# EAGLE design weather-cube_main_board (EAGLE 7.3.0)
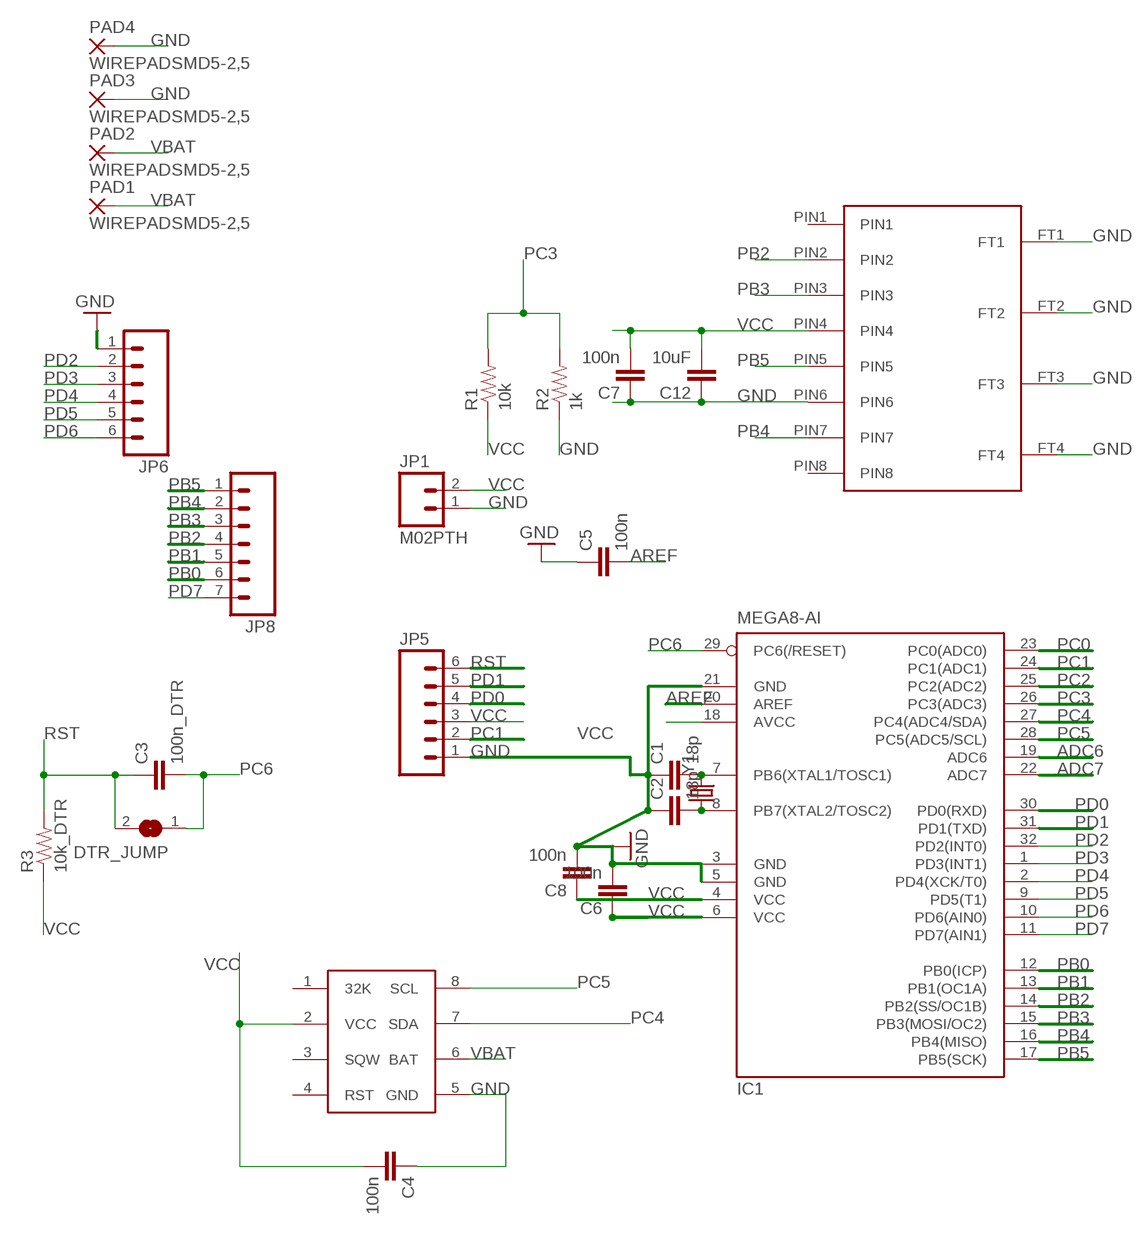
[diagram p0: schematic, sheet 1]

## Parts
*RTC  DS3231M  [DS3231M]
C1  18p  CAP0603-CAP  [0603-CAP]
C2  18p  CAP0603-CAP  [0603-CAP]
C3  100n_DTR  CAP0603-CAP  [0603-CAP]
C4  100n  CAP0603-CAP  [0603-CAP]
C5  100n  CAP0603-CAP  [0603-CAP]
C6  100n  CAP0603-CAP  [0603-CAP]
C7  100n  CAP0603-CAP  [0603-CAP]
C8  100n  CAP0603-CAP  [0603-CAP]
C12  10uF  CAP0603-CAP  [0603-CAP]
DTR_JUMP  SJ  [SJ]
IC1  MEGA8-AI  [TQFP32-08]
JP1  M02PTH  [1X02]
JP5  M06SIP  [1X06]
JP6  M06SIP  [1X06]
JP8  M07  [1X07]
MICRO-SD  MICROSD-1010030368  [MICROSD-1010030368]
PAD1  WIREPADSMD5-2,5  [5-2,5]
PAD2  WIREPADSMD5-2,5  [5-2,5]
PAD3  WIREPADSMD5-2,5  [5-2,5]
PAD4  WIREPADSMD5-2,5  [5-2,5]
R1  10k  RESISTOR0603  [0603-RES]
R2  1k  RESISTOR0603  [0603-RES]
R3  10k_DTR  RESISTOR0603  [0603-RES]
Y1  CRYSTAL5X3  [CRYSTAL-SMD-5X3]

## Nets
ADC6: IC1.19(ADC6)
ADC7: IC1.22(ADC7)
AREF: C5.2 IC1.20(AREF)
GND: *RTC.5(GND) C1.1 C2.1 C4.1 C5.1 C6.2 C7.1 C8.2 C12.1 IC1.3(GND) IC1.5(GND) IC1.21(GND) JP1.1 JP5.1 JP6.1 MICRO-SD.FT1 MICRO-SD.FT2 MICRO-SD.FT3 MICRO-SD.FT4 MICRO-SD.PIN6 PAD3.1(P) PAD4.1(P) R2.1
PB0: IC1.12(PB0(ICP)) JP8.6
PB1: IC1.13(PB1(OC1A)) JP8.5
PB2: IC1.14(PB2(SS/OC1B)) JP8.4 MICRO-SD.PIN2
PB3: IC1.15(PB3(MOSI/OC2)) JP8.3 MICRO-SD.PIN3
PB4: IC1.16(PB4(MISO)) JP8.2 MICRO-SD.PIN7
PB5: IC1.17(PB5(SCK)) JP8.1 MICRO-SD.PIN5
PC0: IC1.23(PC0(ADC0))
PC1: IC1.24(PC1(ADC1)) JP5.2
PC2: IC1.25(PC2(ADC2))
PC3: IC1.26(PC3(ADC3)) R1.2 R2.2
PC4: *RTC.7(SDA) IC1.27(PC4(ADC4/SDA))
PC5: *RTC.8(SCL) IC1.28(PC5(ADC5/SCL))
PC6: C3.2 DTR_JUMP.1 IC1.29(PC6(/RESET))
PD0: IC1.30(PD0(RXD)) JP5.4
PD1: IC1.31(PD1(TXD)) JP5.5
PD2: IC1.32(PD2(INT0)) JP6.2
PD3: IC1.1(PD3(INT1)) JP6.3
PD4: IC1.2(PD4(XCK/T0)) JP6.4
PD5: IC1.9(PD5(T1)) JP6.5
PD6: IC1.10(PD6(AIN0)) JP6.6
PD7: IC1.11(PD7(AIN1)) JP8.7
Q1: C2.2 IC1.8(PB7(XTAL2/TOSC2)) Y1.1
Q2: C1.2 IC1.7(PB6(XTAL1/TOSC1)) Y1.3
RST: C3.1 DTR_JUMP.2 JP5.6 R3.2
VBAT: *RTC.6(BAT) PAD1.1(P) PAD2.1(P)
VCC: *RTC.2(VCC) C4.2 C6.1 C7.2 C8.1 C12.2 IC1.4(VCC) IC1.6(VCC) IC1.18(AVCC) JP1.2 JP5.3 MICRO-SD.PIN4 R1.1 R3.1
Unconnected: *RTC.1(32K) *RTC.3(SQW) *RTC.4(RST) MICRO-SD.PIN1 MICRO-SD.PIN8

## Library data of the parts
*RTC = open_source_turbidimeter:DS3231M
C1-C8 C12 = SparkFun:CAP: Capacitor Standard 0603 ceramic capacitor, and 0.1" leaded capacitor.
DTR_JUMP = jumper:SJ: SMD solder JUMPER
IC1 = atmel:MEGA8: MICROCONTROLLER 8 Kbytes FLASH, 1 kbytes SRAM, 512 bytes EEPROM, USART, 6-channel 10 bit ADC, 2-channel 8 bit ADC Pin compatible with Atmega48, ATMega88, ATMega168 Source: avr.lbr; MPN: ATMEGA8-16AU; OC_FARNELL: 9171371; OC_NEWARK: 73M8863
JP1 = SparkFun-Connectors:M02: Standard 2-pin 0.1" header. Use with - straight break away headers ( PRT-00116) - right angle break away headers (PRT-00553) - swiss pins (PRT-00743) - machine pins (PRT-00117) - female headers (PRT-00115) Molex polarized connector foot print use with: PRT-08233 with associated crimp pins and housings. 2.54_SCREWTERM for use with PRT-10571. 3.5mm Screw Terminal footprints for PRT-08084 5mm Screw Terminal footprints for use with PRT-08433
JP5 JP6 = SparkFun-Connectors:M06: Header 6 Standard 6-pin 0.1" header. Use with straight break away headers (SKU : PRT-00116), right angle break away headers (PRT-00553), swiss pins (PRT-00743), machine pins (PRT-00117), and female headers (PRT-00115). Molex polarized connector foot print use with SKU : PRT-08094 with associated crimp pins and housings. NOTES ON THE VARIANTS LOCK and LOCK_LONGPADS... This footprint was designed to help hold the alignment of a through-hole component (i.e. 6-pin header) while soldering it into place. You may notice that each hole has been shifted either up or down by 0.005 of an inch from it's more standard position (which is a perfectly straight line). This slight alteration caused the pins (the squares in the middle) to touch the edges of the holes. Because they are alternating, it causes a "brace" to hold the component in place. 0.005 has proven to be the perfect amount of "off-center" position when using our standard breakaway headers. Although looks a little odd when you look at the bare footprint, once you have a header in there, the alteration is very hard to notice. Also,if you push a header all the way into place, it is covered up entirely on the bottom side. This idea of altering the position of holes to aid alignment will be further integrated into the Sparkfun Library for other footprints. It can help hold any component with 3 or more connection pins.
JP8 = SparkFun:M07: Header 7 Standard 7-pin 0.1" header. Use with straight break away headers (SKU : PRT-00116), right angle break away headers (PRT-00553), swiss pins (PRT-00743), machine pins (PRT-00117), and female headers (PRT-00115). NOTES ON THE VARIANTS LOCK and LOCK_LONGPADS... This footprint was designed to help hold the alignment of a through-hole component (i.e. 7-pin header) while soldering it into place. You may notice that each hole has been shifted either up or down by 0.005 of an inch from it's more standard position (which is usually a perfectly straight line). This slight alteration caused the pins (the squares in the middle) to touch the edges of the holes. Because they are alternating, it causes a "brace" to hold the header in place. 0.005 has proven to be the perfect amount of "off-center" position when using our standard breakaway headers. Although looks a little odd when you look at the bare footprint, once you have a header in there, the alteration is very hard to notice. Also, if you push a header all the way into place, it is covered up entirely on the bottom side. This idea of altering the position of holes to aid alignment will be further integrated into the Sparkfun Library for other footprints. It can help hold any component with 3 or more connection pins.
MICRO-SD = open_source_turbidimeter:MICROSD-1010030368
PAD1-PAD4 = wirepad:WIREPAD: Wire PAD connect wire on PCB
R1-R3 = SparkFun-Resistors:RESISTOR: Resistor Basic schematic elements and footprints for 0603, 1206, and PTH resistors.
Y1 = SparkFun:CRYSTAL: Crystals Various standard crystals. Proven footprints. Spark Fun Electronics SKU : COM-00534

## Board
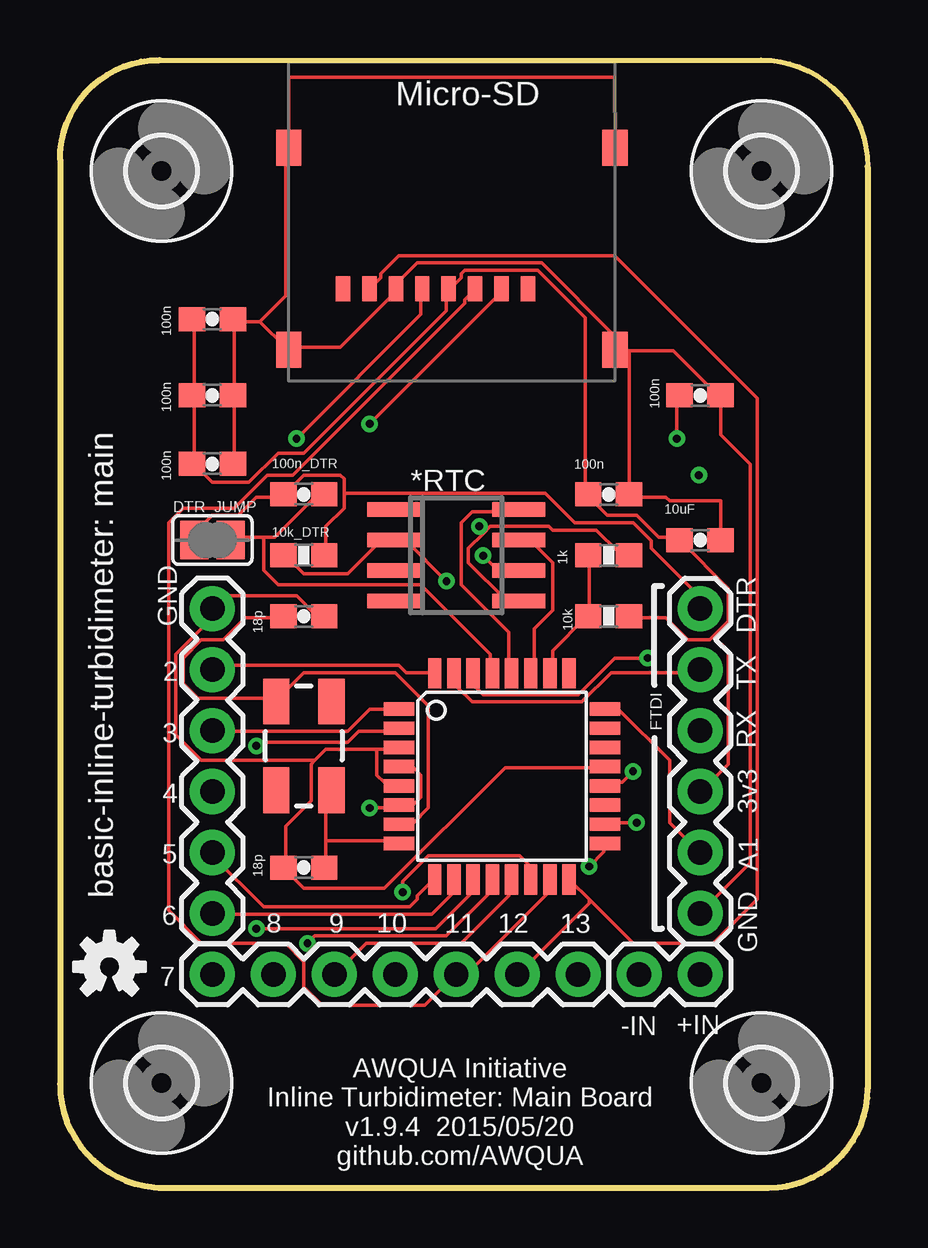
[diagram p1: board, top side]
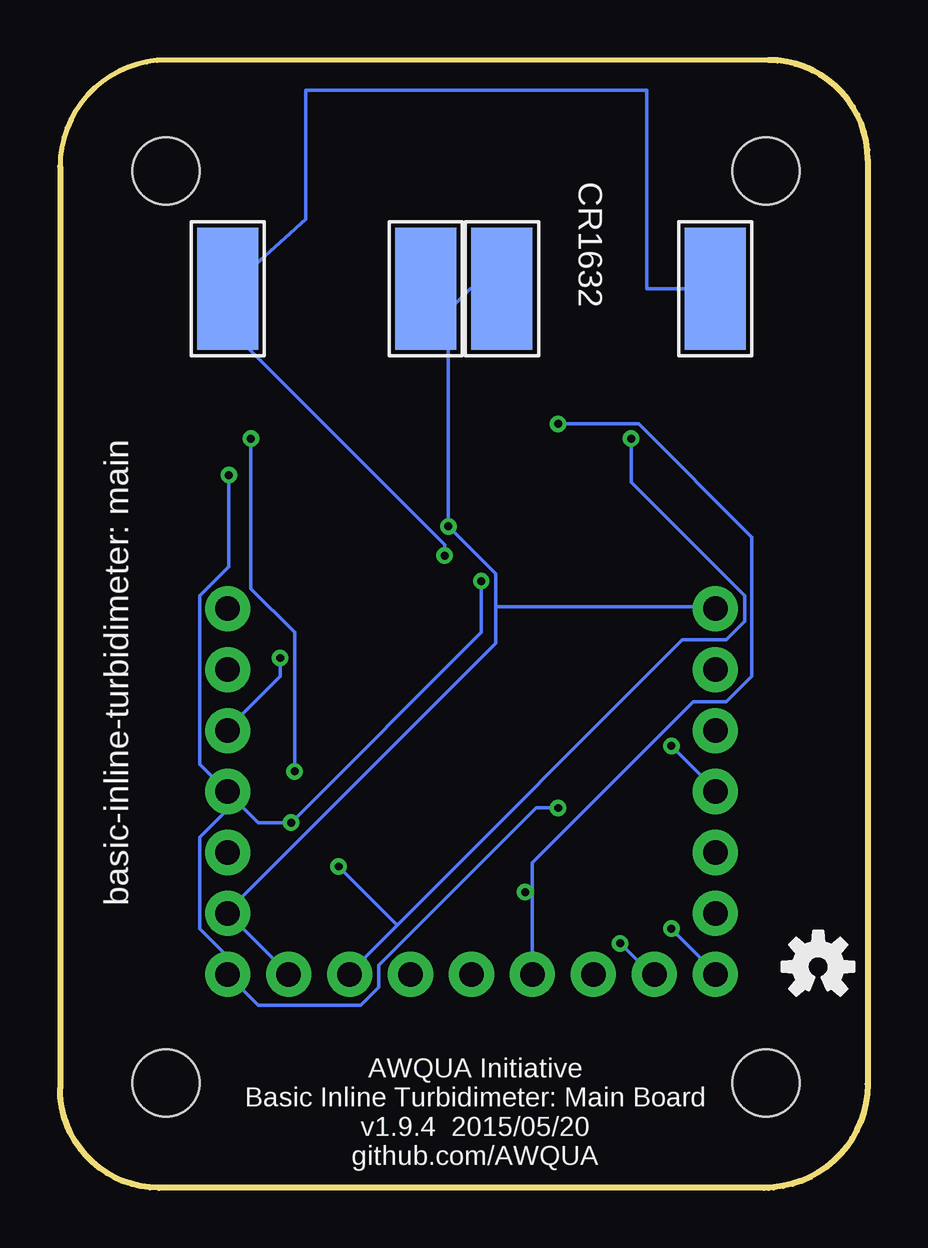
[diagram p2: board, bottom side, seen from below]

Size 33.65 x 46.99 mm. Coordinates in mm from the lower left corner, seen from the top.
Outline: 4.32,0 arc-90 0,4.32 0,42.85 arc-90 4.14,46.99
Outline: 4.13,46.99 29.21,46.99 arc-90 33.65,42.55 33.65,4.13 arc-90 29.53,0 4.13,0
Copper layers (1*16): Top 0.0356mm / dielectric 1.5011mm / Bottom 0.0356mm
Design rules "default *": minimum track width 6mil, minimum drill 13mil, track to track 6mil, track to pad 6mil, pad to pad 6mil, via to via 6mil, smd to smd 6mil, copper to edge 15mil, drill to drill 6mil, minimum pad ring 7mil, minimum via ring 7mil, stop-mask expansion 4mil, vias tented up to drill 15mil, thermal gap 10mil

### Footprints (pad centres in the part's own frame; a part is rotated, then mirrored left to right if it is on the bottom)
DS3231M = smd 2.2 x 0.6: 1 -2.6,1.905; 2 -2.6,0.635; 3 -2.6,-0.635; 4 -2.6,-1.905; 5 2.6,-1.905; 6 2.6,-0.635; 7 2.6,0.635; 8 2.6,1.905
0603-CAP = smd 1.1 x 1: 1 -0.85,0; 2 0.85,0
SJ = smd 1.168 x 1.6: 1 -0.762,0; 2 0.762,0
TQFP32-08 = smd 1.27 x 0.559: 1 -4.293,2.8; 2 -4.293,2; 3 -4.293,1.2; 4 -4.293,0.4; 5 -4.293,-0.4; 6 -4.293,-1.2; 7 -4.293,-2; 8 -4.293,-2.8; 17 4.293,-2.8; 18 4.293,-2; 19 4.293,-1.2; 20 4.293,-0.4; 21 4.293,0.4; 22 4.293,1.2; 23 4.293,2; 24 4.293,2.8 | smd 0.559 x 1.27: 9 -2.8,-4.293; 10 -2,-4.293; 11 -1.2,-4.293; 12 -0.4,-4.293; 13 0.4,-4.293; 14 1.2,-4.293; 15 2,-4.293; 16 2.8,-4.293; 25 2.8,4.293; 26 2,4.293; 27 1.2,4.293; 28 0.4,4.293; 29 -0.4,4.293; 30 -1.2,4.293; 31 -2,4.293; 32 -2.8,4.293
1X02 = drill 1.016 pad 1.88: 1 0,0; 2 2.54,0
1X06 = drill 1.016 pad 1.88: 1 0,0; 2 2.54,0; 3 5.08,0; 4 7.62,0; 5 10.16,0; 6 12.7,0
1X07 = drill 1.016 pad 1.88: 1 0,0; 2 2.54,0; 3 5.08,0; 4 7.62,0; 5 10.16,0; 6 12.7,0; 7 15.24,0
MICROSD-1010030368 = smd 1.05 x 1.5: FT1 0,8.4; FT2 0,0; FT3 13.6,0; FT4 13.6,8.4 | smd 0.6 x 1.05: PIN1 9.97,2.53; PIN2 8.87,2.53; PIN3 7.77,2.53; PIN4 6.67,2.53; PIN5 5.57,2.53; PIN6 4.47,2.53; PIN7 3.37,2.53; PIN8 2.27,2.53
5-2,5 = smd 2.54 x 5.08: 1 0,0
0603-RES = smd 1.1 x 1: 1 -0.85,0; 2 0.85,0
2,8 = hole 2.8: 0,0
CRYSTAL-SMD-5X3 = smd 1.9 x 1.1: 1 -1.85,-1.15; 2 1.85,-1.15; 3 1.85,1.15; 4 -1.85,1.15

### Placement (x,y rotation side)
*RTC  16.51,26.35 0 top
C1  10.16,23.81 180 top
C2  10.16,13.34 0 top
C3  10.16,28.89 0 top
C4  6.35,36.2 180 top
C5  26.67,33.02 180 top
C6  6.35,30.16 0 top
C7  22.86,28.89 180 top
C8  6.35,33.02 0 top
C12  26.67,26.99 180 top
DTR_JUMP  6.35,26.99 180 top
IC1  18.41,17.14 0 top
JP1  24.13,8.89 0 top
JP5  26.67,11.43 90 top
JP6  6.35,24.13 270 top
JP8  21.59,8.89 180 top
MICRO-SD  9.53,34.93 0 top
PAD1  26.67,37.47 0 bottom
PAD2  6.35,37.47 0 bottom
PAD3  18.41,37.47 0 bottom
PAD4  15.24,37.47 0 bottom
R1  22.86,23.81 180 top
R2  22.86,26.35 180 top
R3  10.16,26.35 0 top
U$1  [2,8]  4.23,42.37 0 top
U$2  [OSHW-LOGO-S]  2.06,9.21 0 top
U$3  [2,8]  29.23,42.37 0 top
U$5  [2,8]  29.23,4.37 0 top
U$6  [2,8]  4.23,4.37 0 top
U$8  [OSHW-LOGO-S]  2.06,9.21 0 bottom
Y1  10.16,18.41 90 top

### Tracks (layer width: path | path; a pad name or v marks a point on that pad's centre or on a via)
AREF  (via drill 0.33)
  Top 0.152: v25.71,31.22 25.71,32.89 C5.2 | v23.88,17.35 23.42,16.89 22.81,16.89 IC1.20
  Bottom 0.152: v25.71,31.22 25.71,24.97 23.88,23.14 v23.88,17.35
GND  (via drill 0.33)
  Top 0.152: C12.1 27.53,27.1 27.53,28.63 25.4,28.63 25.25,28.78 23.72,28.78 C7.1 23.72,28.93 23.72,34.87 | 23.72,34.87 23.27,34.87 MICRO-SD.FT3 23.11,35.03 23.11,35.48 20.07,38.53 14.88,38.53 14.12,37.77 14.12,37.47 MICRO-SD.PIN6 13.97,37.31 11.68,35.03 9.55,35.03 MICRO-SD.FT2 9.4,35.03 8.33,36.09 | 23.72,34.87 25.55,34.87 27.38,33.05 C5.1 27.53,32.89 27.53,31.37 28.75,30.15 28.75,13.54 26.77,11.56 JP5.1 | C6.2 7.26,30.3 7.26,32.89 C8.2 7.26,33.05 7.26,36.09 | 8.33,36.09 7.26,36.09 | 8.33,36.09 9.4,37.16 9.4,43.26 MICRO-SD.FT1 9.53,46.27 23.11,46.27 MICRO-SD.FT4 | 7.26,36.09 C4.1 | C1.1 10.92,23.9 10.62,23.9 9.86,24.66 6.81,24.66 6.35,24.21 JP6.1 6.35,23.75 4.83,22.22 4.83,18.87 5.89,17.8 10.62,17.8 | 10.62,17.8 11.07,18.26 13.21,18.26 | 10.62,17.8 10.46,17.65 10.46,16.13 9.4,15.06 9.4,13.39 C2.1 9.4,13.23 10.16,12.47 13.51,12.47 18.54,17.5 22.66,17.5 IC1.21 | 13.21,18.26 14.12,18.26 IC1.3 | 13.21,18.26 13.21,17.2 13.51,16.89 14.12,16.89 IC1.5 | 17.63,27.25 17.02,26.64 17.02,26.04 18.54,24.51 19,24.51 *RTC.5 | 17.63,27.25 17.93,27.56 20.37,27.56 20.52,27.41 22.35,27.41 23.27,26.49 23.57,26.49 R2.1 | 17.63,27.25 17.63,27.41 v17.48,27.56
  Bottom 0.152: JP1.1 24.18,8.97 26.62,11.4 JP5.1 26.62,11.56 15.49,22.68 15.49,24.21 | 17.48,36.55 v17.48,27.56 15.49,25.58 15.49,24.21 | 17.48,36.55 18.39,37.47 PAD3.1 17.48,36.55 | PAD4.1 16.56,37.47 17.48,36.55 | 15.49,24.21 6.35,24.21 JP6.1
PB0  (via drill 0.33)
  Top 0.152: v10.31,10.19 10.62,10.49 16.1,10.49 17.93,12.32 17.93,12.78 IC1.12
  Bottom 0.152: v10.31,10.19 8.94,8.81 JP8.6
PB1
  Top 0.152: IC1.13 18.69,12.78 18.69,12.17 16.71,10.19 12.75,10.19 11.53,8.97 JP8.5
PB2  (via drill 0.33)
  Top 0.152: v12.9,31.83 18.39,37.31 MICRO-SD.PIN2 | v14.28,12.32 14.28,12.78 15.34,13.84 19.15,13.84 19.61,13.39 19.61,12.93 IC1.14
  Bottom 0.152: v12.9,31.83 9.55,31.83 4.83,27.1 4.83,21.31 5.89,20.24 7.26,20.24 13.97,13.54 13.97,12.32 | JP8.4 13.97,12.32 | 13.97,12.32 v14.28,12.32
PB3
  Top 0.152: MICRO-SD.PIN3 17.17,37.31 16.87,37.01 16.87,36.86 9.7,29.69 8.64,29.69 7.26,28.32 5.13,28.32 4.52,27.71 4.52,11.56 5.89,10.19 9.4,10.19 10.16,9.42 10.16,8.36 10.92,7.6 15.19,7.6 16.41,8.81 JP8.3 16.56,8.97 17.02,8.97 20.37,12.32 20.37,12.78 IC1.15
PB4
  Top 0.152: 22.05,12.01 21.29,12.78 IC1.16 | 22.05,12.01 23.88,10.19 27.23,10.19 29.06,12.01 29.06,32.89 23.11,38.84 14.12,38.84 13.36,38.08 13.36,37.92 12.9,37.47 MICRO-SD.PIN7 | 22.05,12.01 22.05,11.86 19.15,8.97 JP8.2
PB5  (via drill 0.33)
  Top 0.152: v9.86,31.22 15.04,36.4 15.04,37.31 MICRO-SD.PIN5 | v22.05,13.39 22.66,14 22.66,14.3 IC1.17
  Bottom 0.152: v9.86,31.22 9.86,29.39 5.13,24.66 5.13,23.6 5.89,22.83 7.72,22.83 19.61,10.95 | 19.61,10.95 21.59,8.97 JP8.1 | 19.61,10.95 v22.05,13.39
PC1
  Top 0.152: IC1.24 22.81,19.94 23.27,19.94 25.4,17.8 25.4,15.21 26.62,14 JP5.2
PC3
  Top 0.152: R2.2 22.05,26.34 22.05,23.9 R1.2 21.89,23.75 20.52,22.38 20.52,21.46 IC1.26
PC4
  Top 0.152: IC1.27 19.76,21.46 19.76,23.29 20.52,24.05 20.52,26.04 19.61,26.95 19.15,26.95 *RTC.7
PC5
  Top 0.152: IC1.28 18.69,21.46 18.69,23.14 16.71,25.12 16.71,27.71 17.17,28.17 19,28.17 *RTC.8
PC6
  Top 0.152: 8.48,27.1 7.11,27.1 DTR_JUMP.1 | 8.48,27.1 8.94,27.1 10.62,28.78 10.92,28.78 C3.2 | 8.48,27.1 8.48,25.73 9.09,25.12 15.04,25.12 17.93,22.22 17.93,21.46 IC1.29
PD0  (via drill 0.33)
  Top 0.152: v24.49,22.07 23.11,22.07 21.59,20.55 17.63,20.55 17.32,20.85 17.32,21.31 IC1.30
  Bottom 0.152: v24.49,22.07 24.49,21.31 26.62,19.18 JP5.4
PD1
  Top 0.152: IC1.31 16.56,21.31 16.56,20.85 17.17,20.24 21.74,20.24 22.96,21.46 26.62,21.46 JP5.5
PD2
  Top 0.152: IC1.32 15.49,21.46 14.43,21.46 14.12,21.77 6.5,21.77 6.35,21.61 JP6.2
PD3
  Top 0.152: IC1.1 12.9,19.94 11.99,19.02 6.35,19.02 JP6.3
PD4  (via drill 0.33)
  Top 0.152: v8.18,18.41 8.33,18.57 11.99,18.57 12.45,19.02 14.12,19.02 IC1.2
  Bottom 0.152: v8.18,18.41 6.35,16.59 JP6.4
PD5
  Top 0.152: IC1.9 15.49,12.78 14.88,12.17 14.88,12.01 14.58,11.71 8.48,11.71 6.35,13.84 JP6.5
PD6
  Top 0.152: IC1.10 16.41,12.78 16.41,12.32 15.49,11.4 6.35,11.4 JP6.6
PD7  (via drill 0.33)
  Top 0.152: v8.18,10.79 15.65,10.79 17.17,12.32 17.17,12.78 IC1.11
  Bottom 0.152: v8.18,10.79 6.35,8.97 JP8.7
Q1
  Top 0.152: 11.07,14.45 11.07,16.28 11.23,16.43 Y1.1 | 11.07,14.45 11.07,13.39 C2.2 | 11.07,14.45 14.12,14.45 IC1.8
Q2
  Top 0.152: C1.2 9.25,23.75 7.72,23.75 6.81,22.83 5.89,22.83 5.13,22.07 5.13,21.01 5.74,20.4 8.94,20.4 Y1.3 9.09,20.4 10.16,21.46 13.97,21.46 15.34,20.09 15.34,15.82 14.73,15.21 14.12,15.21 IC1.7
RST
  Top 0.152: DTR_JUMP.2 5.59,27.25 6.35,28.02 7.42,28.02 8.18,28.78 9.25,28.78 C3.1 9.4,28.93 10.16,29.69 11.68,29.69 11.84,29.54 11.84,28.93 | 11.84,28.93 11.84,28.32 11.07,27.56 11.07,26.49 R3.2 | 11.84,28.93 20.22,28.93 21.44,27.71 23.88,27.71 24.64,26.95 24.64,26.64 26.62,24.66 26.62,24.21 JP5.6
VBAT  (via drill 0.33)
  Top 0.152: v17.63,26.34 18.24,25.73 19,25.73 *RTC.6
  Bottom 0.152: v17.63,26.34 17.63,26.8 26.62,35.79 26.62,37.47 | 26.62,37.47 23.41,40.36 23.41,45.72 9.21,45.72 9.21,37.47 PAD2.1 | 26.62,37.47 PAD1.1
VCC  (via drill 0.33)
  Top 0.152: 27.23,22.99 27.84,23.6 27.84,24.97 25.86,26.95 C12.2 25.71,27.1 24.94,27.1 24.03,28.02 22.81,28.02 22.05,28.78 C7.2 21.89,28.93 21.89,36.25 19.91,38.23 16.87,38.23 16.71,38.08 16.71,37.92 16.26,37.47 MICRO-SD.PIN4 16.1,37.31 16.1,36.55 10.16,30.61 9.09,30.61 7.87,29.39 6.35,29.39 5.59,30.15 C6.1 5.59,30.3 5.59,32.89 C8.1 5.59,33.05 5.59,36.09 C4.2 | 27.23,22.99 27.08,22.83 26.16,22.83 25.25,23.75 23.72,23.75 R1.1 | IC1.4 14.12,17.5 14.73,17.5 15.04,17.2 15.04,16.28 14.73,15.98 14.12,15.98 IC1.6 14.12,15.82 v12.9,15.82 | R3.1 9.4,26.34 10.16,25.58 11.99,25.58 13.36,26.95 13.82,26.95 *RTC.2 13.97,26.95 14.43,26.95 v16.1,25.27 | v24.03,15.21 22.81,15.21 IC1.18 | 27.23,22.99 27.84,22.38 27.84,17.65 26.77,16.59 JP5.3
  Bottom 0.152: v12.9,15.82 13.82,15.82 20.37,9.27 20.37,8.36 21.13,7.6 25.4,7.6 26.62,8.81 JP1.2 26.77,8.97 26.77,9.73 27.84,10.79 27.84,14.61 26.31,16.13 | v26.62,29.69 26.62,25.88 27.84,24.66 27.84,17.65 26.77,16.59 JP5.3 | 26.31,16.13 26.62,16.43 JP5.3 | 26.31,16.13 25.4,15.21 v24.03,15.21 16.1,23.14 v16.1,25.27 | 26.31,16.13 JP5.3

### Text on the board
tPlace: DTR | 2 | TX | RX | 3 | FTDI | 3v3 | 4 | 5 | A1 | GND | 6 | 8 | 9 | 10 | 11 | 12 | 13 | 7 | -IN | +IN | AWQUA Initiative / Inline Turbidimeter: Main Board / v1.9.4 2015/05/20 / github.com/AWQUA
bPlace: AWQUA Initiative / Basic Inline Turbidimeter: Main Board / v1.9.4 2015/05/20 / github.com/AWQUA
tNames: Micro-SD | GND | basic-inline-turbidimeter: main
bNames: CR1632 | basic-inline-turbidimeter: main